# Altium schematic sheet MaiChe.SchDoc
size A; SheetNumber: 1; SheetTotal: 1
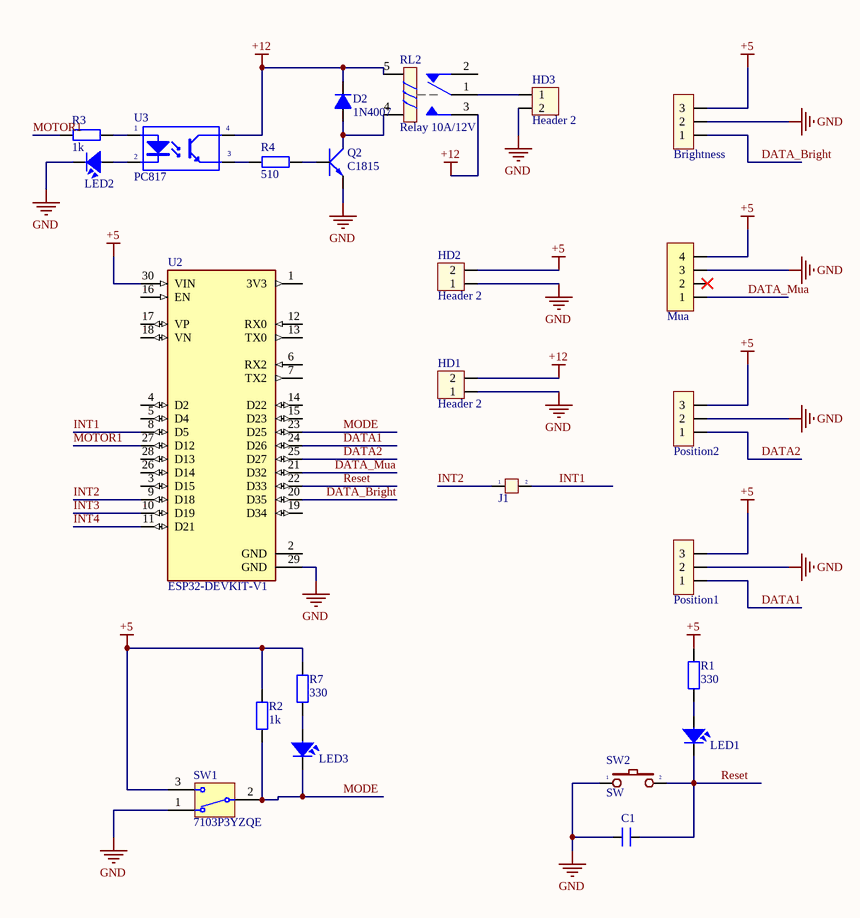
[diagram p0: MaiChe.SchDoc]

## Parts
Brightness  Jumper 3  [JP3]  (value not drawn)
C1  100pF  [CN1]  (value not drawn)
D2  1N4007  [D1A]
HD1  Header 2  [HED2]
HD2  Header 2  [HED2]
HD3  Header 2  [HED2]
J1  Jumper 2  [jp2h]  (value not drawn)
LED1  LED  [LED-3MM-YELLOW]  (value not drawn)
LED2  LED  [LED-3MM-YELLOW]  (value not drawn)
LED3  LED  [LED-3MM-YELLOW]  (value not drawn)
Mua  JP 1x4 2.54  [JP 1x4 CC]  (value not drawn)
Position1  Jumper 3  [JP3]  (value not drawn)
Position2  Jumper 3  [JP3]  (value not drawn)
Q2  C1815  [QTO-92]
R1  330  [R1/4W]
R2  1k  [R1/4W]
R3  1k  [R1/4W]
R4  510  [R1/4W]
R7  330  [R1/4W]
RL2  Relay 10A/12V  [RL_SPDT_10A]
SW1  7103P3YZQE  [SW_TOGGLE_7103P3YZQE]
SW2  SW  [SW2]
U2  ESP32-DEVKIT-V1  [MODULE_ESP32_DEVKIT_V1]
U3  PC817  [DIP4/W0.3]

## Nets
+5: Brightness.3 HD2.2 Mua.4 Position1.3 Position2.3 R1.1 R2.1 R7.1 SW1.3(NO) U2.30(VIN)
+12: D2.2(K) HD1.2 RL2.3 RL2.5 U3.4(C)
GND: Brightness.2 C1.1 HD1.1 HD2.1 HD3.2 LED2.2 Mua.3 Position1.2 Position2.2 Q2.1(E) SW1.1(NC) SW2.1 U2.29(GND)
DATA1: Position1.1 U2.24(D26)
DATA2: Position2.1 U2.25(D27)
DATA_Bright: Brightness.1 U2.20(D35)
DATA_Mua: Mua.1 U2.21(D32)
INT1: J1.2 U2.8(D5)
INT2: J1.1 U2.9(D18)
INT3: U2.10(D19)
INT4: U2.11(D21)
MODE: LED3.2 R2.2 SW1.2(COM) U2.23(D25)
MOTOR1: R3.2 U2.27(D12)
Reset: C1.2 LED1.2 SW2.2 U2.22(D33)
NetD2_1: D2.1(A) Q2.2(C) RL2.4
NetHD3_1: HD3.1 RL2.1
NetLED1_1: LED1.1 R1.2
NetLED2_1: LED2.1 U3.2(K)
NetLED3_1: LED3.1 R7.2
NetQ2_3: Q2.3(B) R4.1
NetR3_1: R3.1 U3.1(A)
NetR4_2: R4.2 U3.3(E)

Not connected (* = marked no-connect by the designer): Mua 2*; RL2 2; U2 1(3V3) 2(GND) 3(D15) 4(D2) 5(D4) 6(RX2) 7(TX2) 12(RX0) 13(TX0) 14(D22) 15(D23) 16(EN) 17(VP) 18(VN) 19(D34) 26(D14) 28(D13)

## Library data of the parts
Brightness Position1 Position2 = JP3: Value: J3
C1 = CN1: Cap np  1pF - 472pF; Value: 100pF
D2 = D1A: Diode 1A; Value: 1N4007
HD1-HD3 = Hed2: Header 2 (Green); Value: Header 2
J1 = JP 2: Value: JP 2
LED1-LED3 = LED: LED Single colour Green and Red; Value: LED 3 ly Single Colour
Mua = JP 1x4 2.54 Cai Cong: Cắm; Ten_Linh_Kien: Jump Đơn Cái 2.54MM 1x40P Cong; Don_Vi: Con; Ma_Hang: MH001265; Ghi_Chu: *; Kieu_Chan: *; Chung_Loai: Cắm
Q2 = C1815: NPN 600mW, ECB; Value: C1815
R1-R4 R7 = R1/4W: Resistor 1/4W; Value: R1/4W - 1K
RL2 = Relay 1: Relay SPDT,10A - 12VDC 5 Pin; Value: Relay SPDT, 10A, 12V
SW1 = SW_TOGGLE_7103P3YZQE: SWITCH TOGGLE SPDT 5A 120V; Manufacturer: C&K; Switch Function: On-Off-On; Current Rating: 5A (AC/DC); Actuator Type: Flat Anti-Rotation; Actuator Length: 11.43mm; Illumination: Non-Illuminated; Actuator Material: Brass, Chrome Plated; Electrical Life: 40,000 Cycles; Supplier 1: Digi-Key; Manufacturer Part Number: 7103P3YZQE; RoHS: RoHS Compliant; Category: Switches; Stock 1: 335; Pricing 1: 1=7.89, 10=7.496, 25=7.2984, 50=7.101, 100=6.9038, 250=6.50924, 500=5.523, 1000=5.22713 (USD); Packaging: Bulk; Part Status: Active; Circuit: SPDT; Illumination Type, Color: -; Illumination Voltage (Nominal): -; Mounting Type: Panel Mount; Termination Style: Solder Lug; Panel Cutout Dimensions: Circular - 6.35mm Dia; Bushing Thread: 1/4-40; Ingress Protection: -; Features: Epoxy Sealed Terminals; Operating Temperature: -30°C ~ 85°C; ComponentLink1URL: http://www.ckswitches.com/media/1394/7000toggle.pdf; ComponentLink1Description: http://www.ckswitches.com/media/1394/7000toggle.pdf; Supplier Part Number 1: CKN1024-ND
SW2 = SW2: Switch button 2 pin; Value: SW chip 2 pin
U2 = ESP32-DEVKIT-V1: Dual core, Wi-Fi: 2.4 GHz up to 150 Mbits/s,BLE (Bluetooth Low Energy) and legacy Bluetooth, 32 bits, Up to 240 MHz; MF: Do it; Value: *; MP: ESP32-DEVKIT-V1; SnapEDA_Link: https://www.snapeda.com/parts/ESP32-DEVKIT-V1/Do+it/view-part/?ref=snap; Price: None; Package: None; Check_prices: https://www.snapeda.com/parts/ESP32-DEVKIT-V1/Do+it/view-part/?ref=eda; Availability: Not in stock
U3 = PC817: Single Opto; Value: PC817